# Altium schematic sheet TXPA-24dB.SchDoc: Transmitter PA #2
size Legal; CheckedBy: J. Brinton; CompanyName: Signal Laboratories, Inc.; DrawnBy: J. Brinton; Engineer: J. Brinton; Address1: 3479 Edison Way; Address2: Menlo Park CA 94025; Address3: +1 (877) 778-8435; Address4: siglabs.com; DocumentNumber: 57; Revision: 2b; SheetNumber: 58; SheetTotal: 58
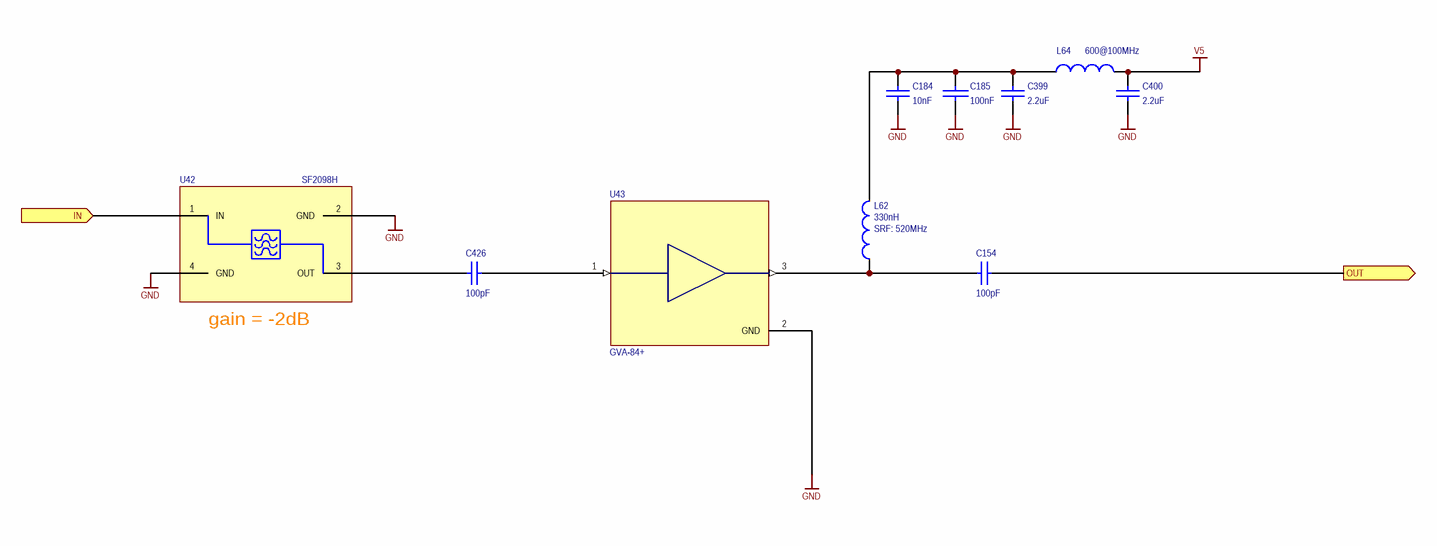
[diagram p0: TXPA-24dB.SchDoc]

## Parts
C154  value 100pF  [0402]  (hidden comment: CBR04C101F3GAC)
C184  value 10nF  [0402]  (hidden comment: GRM155R71E103KA01D)
C185  value 100nF  [0402]  (hidden comment: GRM155R71C104KA88J)
C399  value 2.2uF  [0805]  (hidden comment: GRM21BR71C225KA12L)
C400  value 2.2uF  [0805]  (hidden comment: GRM21BR71C225KA12L)
C426  value 100pF  [0402]  (hidden comment: CBR04C101F3GAC)
L62  value 330nH  SRF: 520MHz  [INDC1005X55N]  (hidden comment: LQW15CNR33J10D)
L64  value 600@100MHz  [0402]  (hidden comment: BLM15PX601SN1D)
U42  SF2098H  [SM2016-4]
U43  GVA-84+  [SOT89]

## Ports
IN (in), OUT (out)

## Nets
GND: C184.1 C185.1 C399.1 C400.1 U42.2(GND) U42.4(GND) U43.2(GND)
V5: C400.2 L64.1
IN: U42.1(IN) ; port IN
OUT: C154.2 ; port OUT
NetC154_1: C154.1 L62.1 U43.3(RFOUT)
NetC184_2: C184.2 C185.2 C399.2 L62.2 L64.2
NetC426_1: C426.1 U42.3(OUT)
NetC426_2: C426.2 U43.1(RFIN)

## Notes on the sheet
- (near U42) gain = -2dB
- Title
- Engineer
- Revision
- Drawn By
- Checked By
- Date
- Sheet
- of

## Library data of the parts
C154 C426 = CAP 0603: Ceramic Capacitor 100pF ±1% 25V NP0 0402; Manufacturer: Kemet; Tr: -55:125; Voltage: 25V; Manufacturer P/N: CBR04C101F3GAC; Package: 0402; Tolerance: ±1%
C184 = CAP 0402: Ceramic Capacitor 10nF ±10% 25V X7R 0402; Manufacturer: Murata; Tr: -55:125; Voltage: 25V; Manufacturer P/N: GRM155R71E103KA01D; Package: 0402; Tolerance: ±10%
C185 = CAP: Ceramic Capacitor 100nF ±10% 16V X7R 0402; Manufacturer: Murata; Tr: -55:125; Manufacturer P/N: GRM155R71C104KA88J; Voltage: 16V; Package: 0402; Tolerance: ±10%
C399 C400 = CAP 0805: Ceramic Capacitor 2.2uF ±10% 10V X7R 0805; Manufacturer: Murata; Tr: -55:125; Voltage: 10V; Manufacturer P/N: GRM21BR71C225KA12L; Package: 0805; Do Not Place: *; Tolerance: ±10%
L62 = IND 0603: Wirewound Inductor 330nH 390mA 0402; Manufacturer: Murata; PCB Package: 0402; Manufacturer P/N: LQW15CNR33J10D; Do Not Place: *
L64 = IND 0402: Ferrite Bead 600-Ohm @ 100MHz 900mA 0402; Manufacturer: Murata; Tolerance: ±25%; Tr: -55:125; Manufacturer P/N: BLM15PX601SN1D; Package: 0402
U42 = SF2098H: 915 MHz SAW Filter; Manufacturer: RFM; Manufacturer P/N: SF2098H
U43 = GVA-84+: High Gain Monolithic Amplifier, DC-7GHz 24dB Gain; Manufacturer: Mini-Circuits; Manufacturer P/N: GVA-84+